# EAGLE design M2k_Breadboard_r1 (EAGLE 7.7.0)
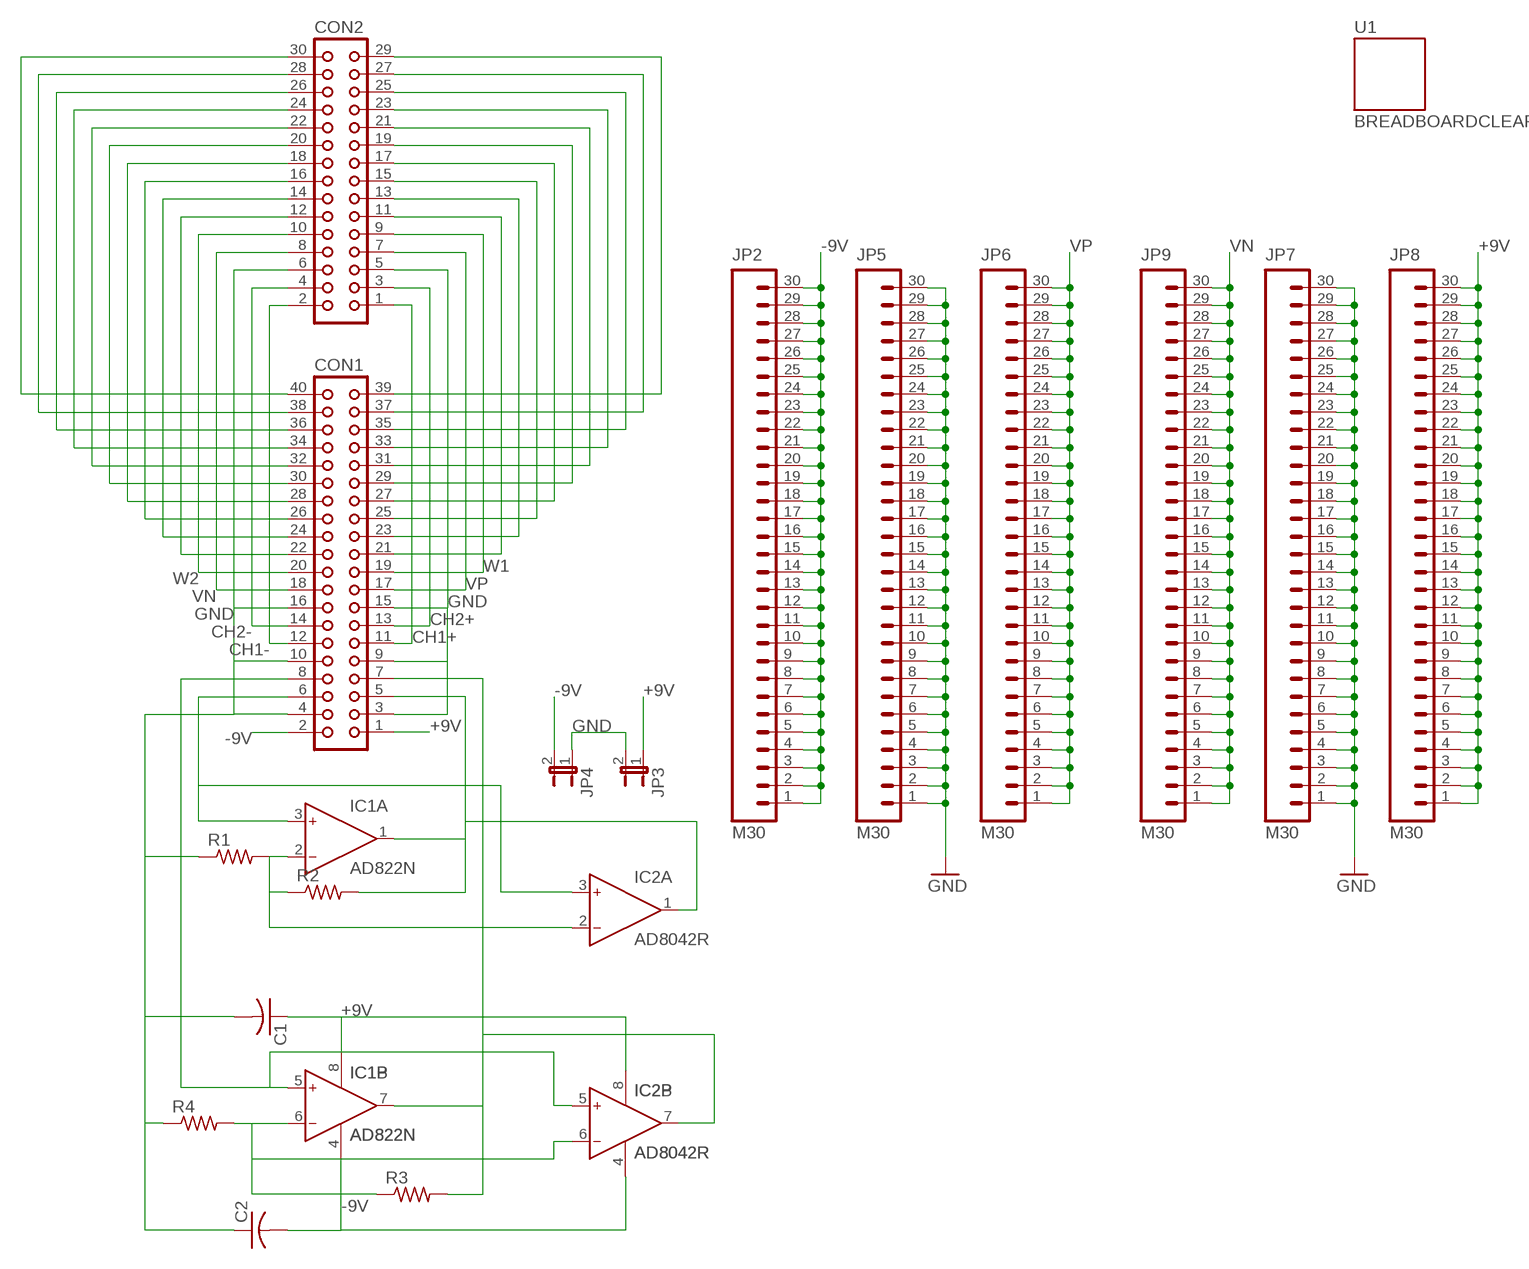
[diagram p0: schematic, sheet 1]

## Parts
C1  C-US050-024X044  [C050-024X044]
C2  C-US050-024X044  [C050-024X044]
CON1  CON40  [CON40]
CON2  CON34  [CON34]
IC1  AD822N  [DIL08]
IC2  AD8042R  [SO8]
JP2  M30  [1X30]
JP3  JP1E  [JP1]
JP4  JP1E  [JP1]
JP5  M30  [1X30]
JP6  M30  [1X30]
JP7  M30  [1X30]
JP8  M30  [1X30]
JP9  M30  [1X30]
R1  R-US_0207/7  [0207/7]
R2  R-US_0207/7  [0207/7]
R3  R-US_0207/7  [0207/7]
R4  R-US_0207/7  [0207/7]
U1  BREADBOARDCLEAR  [BREADBOARD_CLEAR]

## Nets
+9V: C1.1 CON1.1 IC1.8(P:V+) IC2.8(P:V+) JP3.1 JP8.1 JP8.2 JP8.3 JP8.4 JP8.5 JP8.6 JP8.7 JP8.8 JP8.9 JP8.10 JP8.11 JP8.12 JP8.13 JP8.14 JP8.15 JP8.16 JP8.17 JP8.18 JP8.19 JP8.20 JP8.21 JP8.22 JP8.23 JP8.24 JP8.25 JP8.26 JP8.27 JP8.28 JP8.29 JP8.30
-9V: C2.2 CON1.2 IC1.4(P:V-) IC2.4(P:V-) JP2.1 JP2.2 JP2.3 JP2.4 JP2.5 JP2.6 JP2.7 JP2.8 JP2.9 JP2.10 JP2.11 JP2.12 JP2.13 JP2.14 JP2.15 JP2.16 JP2.17 JP2.18 JP2.19 JP2.20 JP2.21 JP2.22 JP2.23 JP2.24 JP2.25 JP2.26 JP2.27 JP2.28 JP2.29 JP2.30 JP4.2
CH1+: CON1.11 CON2.1
CH1-: CON1.12 CON2.2
CH2+: CON1.13 CON2.3
CH2-: CON1.14 CON2.4
GND: C1.2 C2.1 CON1.3 CON1.4 CON1.9 CON1.10 CON1.15 CON1.16 CON2.5 CON2.6 JP3.2 JP4.1 JP5.1 JP5.2 JP5.3 JP5.4 JP5.5 JP5.6 JP5.7 JP5.8 JP5.9 JP5.10 JP5.11 JP5.12 JP5.13 JP5.14 JP5.15 JP5.16 JP5.17 JP5.18 JP5.19 JP5.20 JP5.21 JP5.22 JP5.23 JP5.24 JP5.25 JP5.26 JP5.27 JP5.28 JP5.29 JP5.30 JP7.1 JP7.2 JP7.3 JP7.4 JP7.5 JP7.6 JP7.7 JP7.8 JP7.9 JP7.10 JP7.11 JP7.12 JP7.13 JP7.14 JP7.15 JP7.16 JP7.17 JP7.18 JP7.19 JP7.20 JP7.21 JP7.22 JP7.23 JP7.24 JP7.25 JP7.26 JP7.27 JP7.28 JP7.29 JP7.30 R1.1 R4.1
N$4: CON1.5 IC1.1(A:OUT) IC2.1(A:OUT) R2.2
N$19: CON1.6 IC1.3(A:IN+) IC2.3(A:IN+)
N$32: CON1.8 IC1.5(B:IN+) IC2.5(B:IN+)
N$34: CON1.7 IC1.7(B:OUT) IC2.7(B:OUT) R3.2
N$35: IC1.6(B:IN-) IC2.6(B:IN-) R3.1 R4.2
N$50: CON1.21 CON2.11
N$65: CON1.23 CON2.13
N$81: CON1.25 CON2.15
N$83: CON1.27 CON2.17
N$85: CON1.29 CON2.19
N$86: CON1.31 CON2.21
N$101: CON1.33 CON2.23
N$116: CON1.35 CON2.25
N$132: CON1.37 CON2.27
N$134: CON1.39 CON2.29
N$153: IC1.2(A:IN-) IC2.2(A:IN-) R1.2 R2.1
N$156: CON1.22 CON2.12
N$157: CON1.24 CON2.14
N$158: CON1.26 CON2.16
N$159: CON1.28 CON2.18
N$160: CON1.30 CON2.20
N$161: CON1.32 CON2.22
N$162: CON1.34 CON2.24
N$163: CON1.36 CON2.26
N$164: CON1.38 CON2.28
N$165: CON1.40 CON2.30
VN: CON1.18 CON2.8 JP9.1 JP9.2 JP9.3 JP9.4 JP9.5 JP9.6 JP9.7 JP9.8 JP9.9 JP9.10 JP9.11 JP9.12 JP9.13 JP9.14 JP9.15 JP9.16 JP9.17 JP9.18 JP9.19 JP9.20 JP9.21 JP9.22 JP9.23 JP9.24 JP9.25 JP9.26 JP9.27 JP9.28 JP9.29 JP9.30
VP: CON1.17 CON2.7 JP6.1 JP6.2 JP6.3 JP6.4 JP6.5 JP6.6 JP6.7 JP6.8 JP6.9 JP6.10 JP6.11 JP6.12 JP6.13 JP6.14 JP6.15 JP6.16 JP6.17 JP6.18 JP6.19 JP6.20 JP6.21 JP6.22 JP6.23 JP6.24 JP6.25 JP6.26 JP6.27 JP6.28 JP6.29 JP6.30
W1: CON1.19 CON2.9
W2: CON1.20 CON2.10

## Library data of the parts
C1 C2 = rcl:C-US: CAPACITOR, American symbol
CON1 = con-harting:CON40: CONNECTOR; OC_FARNELL: unknown; OC_NEWARK: unknown
CON2 = con-harting:CON34: CONNECTOR; OC_FARNELL: unknown; OC_NEWARK: unknown
IC1 = analog-devices:AD822: Single-Supply, Rail-to-Rail Low Power FET-Input Op Amp Source: http://www.analog.com/static/imported-files/data_sheets/AD822.pdf; OC_FARNELL: 1438581; OC_NEWARK: unknown
IC2 = analog-devices:AD8042: Dual 160 MHz Rail-to-Rail Amplifier Source: http://www.analog.com/static/imported-files/data_sheets/AD8042.pdf; MF: ALTERA CORPORATION; MPN: AD8042AR; OC_FARNELL: 1424032; OC_NEWARK: 52F8034
JP2 JP5-JP9 = Local Library:M30
JP3 JP4 = jumper:JP1E: JUMPER
R1-R4 = rcl:R-US_: RESISTOR, American symbol
U1 = Local Lirary:BREADBOARD: Breadboard Mini Self Adhesive This is the mechnical outline for the very small self adhesive breadboard from SparkFun Electronics. Good for very small proto areas. SKU : PRT-07916

## Board
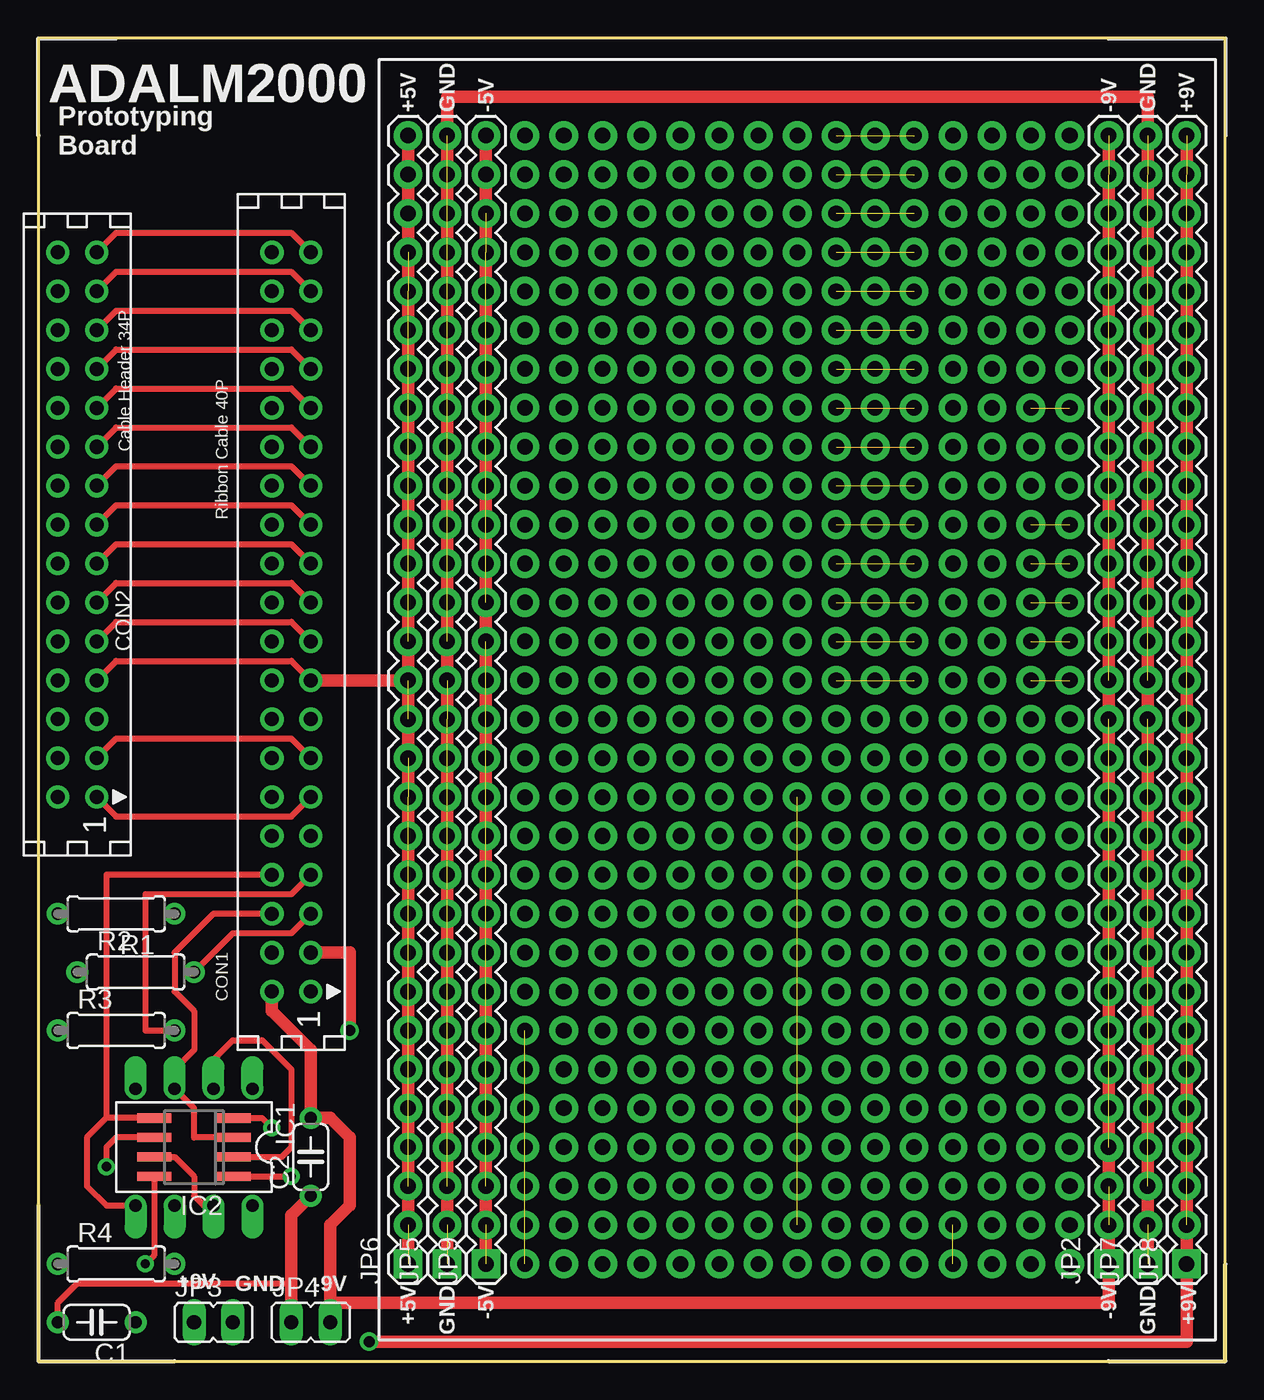
[diagram p1: board, top side]
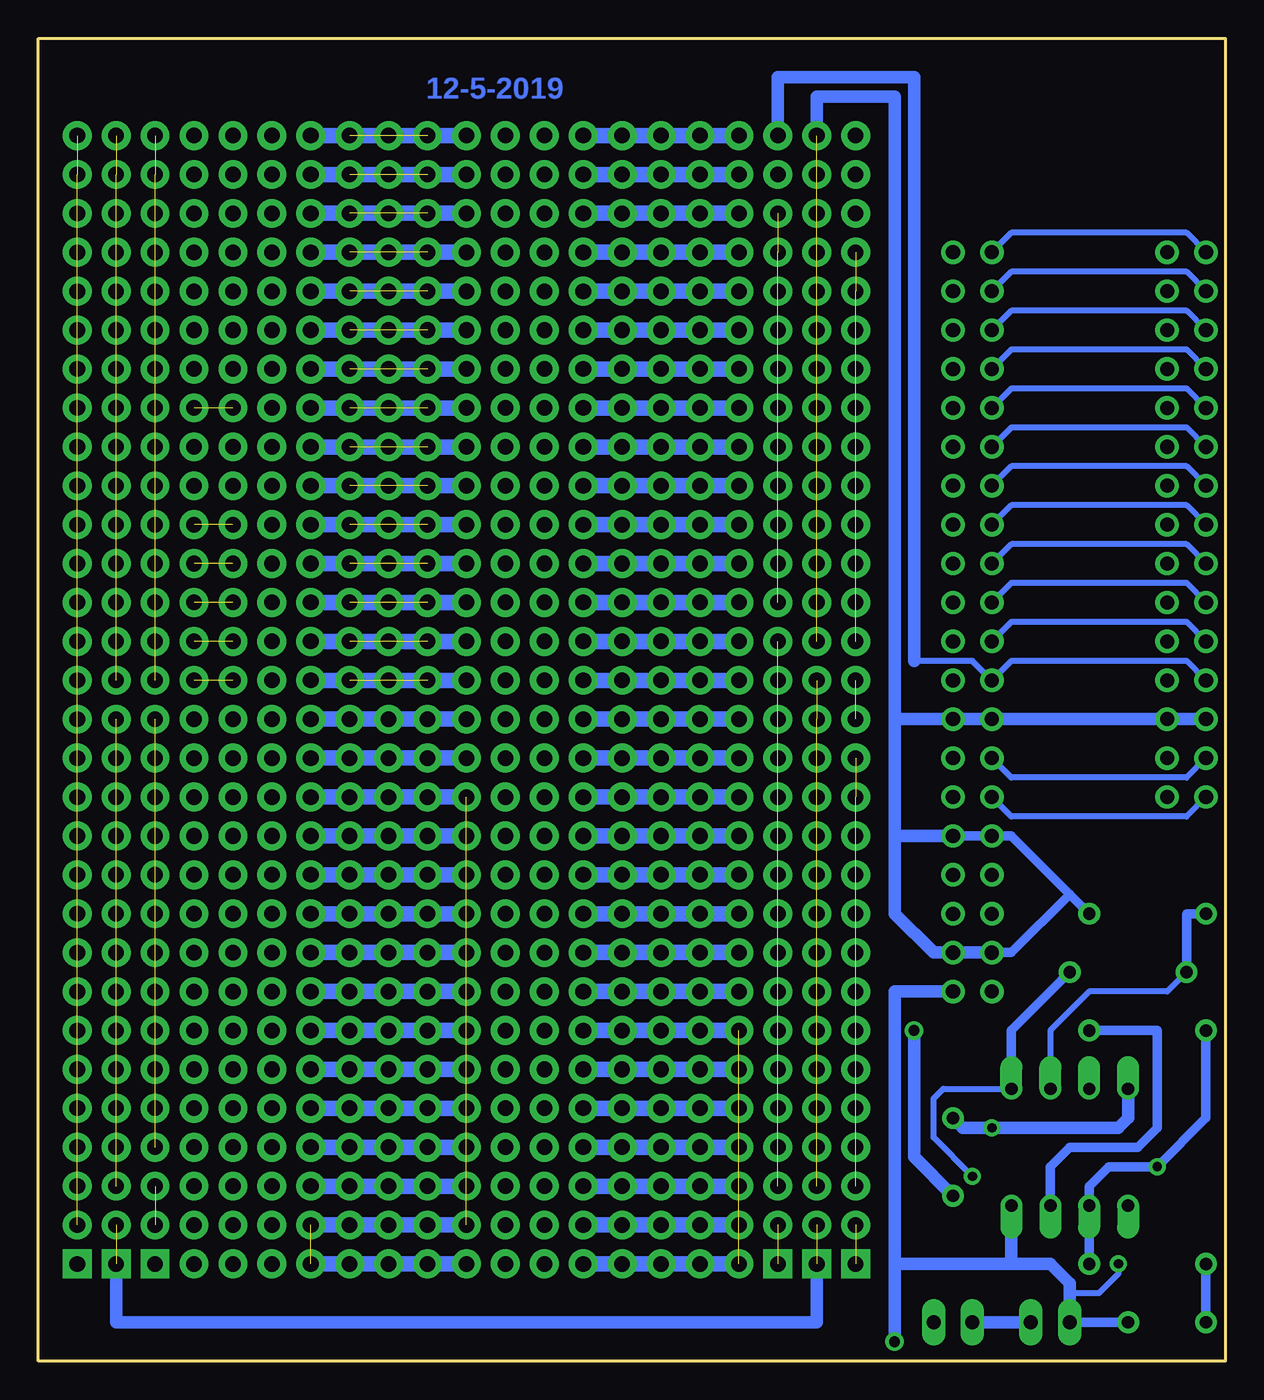
[diagram p2: board, bottom side, seen from below]

Size 77.47 x 86.36 mm. Coordinates in mm from the lower left corner, seen from the top.
Outline: 77.47,0 77.47,86.36 0,86.36 0,0 77.47,0
Copper layers (1*16): Top 0.035mm / dielectric 1.5mm / Bottom 0.035mm
Design rules "default": minimum track width 8mil, minimum drill 20mil, track to track 8mil, track to pad 8mil, pad to pad 8mil, via to via 8mil, smd to smd 8mil, copper to edge 8mil, drill to drill 8mil, minimum pad ring 12mil, minimum via ring 10mil, stop-mask expansion 4mil, vias tented up to drill 20mil, thermal gap 10mil

### Footprints (pad centres in the part's own frame; a part is rotated, then mirrored left to right if it is on the bottom)
C050-024X044 = drill 0.813: 1 -2.54,0; 2 2.54,0
CON40 = drill 0.914: 1 -24.13,-1.27; 2 -24.13,1.27; 3 -21.59,-1.27; 4 -21.59,1.27; 5 -19.05,-1.27; 6 -19.05,1.27; 7 -16.51,-1.27; 8 -16.51,1.27; 9 -13.97,-1.27; 10 -13.97,1.27; 11 -11.43,-1.27; 12 -11.43,1.27; 13 -8.89,-1.27; 14 -8.89,1.27; 15 -6.35,-1.27; 16 -6.35,1.27; 17 -3.81,-1.27; 18 -3.81,1.27; 19 -1.27,-1.27; 20 -1.27,1.27; 21 1.27,-1.27; 22 1.27,1.27; 23 3.81,-1.27; 24 3.81,1.27; 25 6.35,-1.27; 26 6.35,1.27; 27 8.89,-1.27; 28 8.89,1.27; 29 11.43,-1.27; 30 11.43,1.27; 31 13.97,-1.27; 32 13.97,1.27; 33 16.51,-1.27; 34 16.51,1.27; 35 19.05,-1.27; 36 19.05,1.27; 37 21.59,-1.27; 38 21.59,1.27; 39 24.13,-1.27; 40 24.13,1.27
CON34 = drill 0.914: 1 -20.32,-1.27; 2 -20.32,1.27; 3 -17.78,-1.27; 4 -17.78,1.27; 5 -15.24,-1.27; 6 -15.24,1.27; 7 -12.7,-1.27; 8 -12.7,1.27; 9 -10.16,-1.27; 10 -10.16,1.27; 11 -7.62,-1.27; 12 -7.62,1.27; 13 -5.08,-1.27; 14 -5.08,1.27; 15 -2.54,-1.27; 16 -2.54,1.27; 17 0,-1.27; 18 0,1.27; 19 2.54,-1.27; 20 2.54,1.27; 21 5.08,-1.27; 22 5.08,1.27; 23 7.62,-1.27; 24 7.62,1.27; 25 10.16,-1.27; 26 10.16,1.27; 27 12.7,-1.27; 28 12.7,1.27; 29 15.24,-1.27; 30 15.24,1.27
DIL08 = drill 0.813 offset: 1 -3.81,-3.81; 2 -1.27,-3.81; 3 1.27,-3.81; 4 3.81,-3.81; 5 3.81,3.81; 6 1.27,3.81; 7 -1.27,3.81; 8 -3.81,3.81
SO8 = smd 0.6 x 2.2: 1 -1.905,-2.6; 2 -0.635,-2.6; 3 0.635,-2.6; 4 1.905,-2.6; 5 1.905,2.6; 6 0.635,2.6; 7 -0.635,2.6; 8 -1.905,2.6
1X30 = drill 1.016 pad 1.88 square: 1 0,0 | drill 1.016 pad 1.88: 2 2.54,0; 3 5.08,0; 4 7.62,0; 5 10.16,0; 6 12.7,0; 7 15.24,0; 8 17.78,0; 9 20.32,0; 10 22.86,0; 11 25.4,0; 12 27.94,0; 13 30.48,0; 14 33.02,0; 15 35.56,0; 16 38.1,0; 17 40.64,0; 18 43.18,0; 19 45.72,0; 20 48.26,0; 21 50.8,0; 22 53.34,0; 23 55.88,0; 24 58.42,0; 25 60.96,0; 26 63.5,0; 27 66.04,0; 28 68.58,0; 29 71.12,0; 30 73.66,0
JP1 = drill 0.914 long: 1 0,-1.27; 2 0,1.27
0207/7 = drill 0.813: 1 -3.81,0; 2 3.81,0

### Placement (x,y rotation side)
C1  3.81,2.54 180 top
C2  17.78,13.34 90 top
CON1  16.51,48.26 90 top
CON2  2.54,57.15 90 top
IC1  10.16,13.97 180 top
IC2  10.16,13.97 90 top
JP2  69.85,6.35 90 top
JP3  11.43,2.54 270 top
JP4  17.78,2.54 270 top
JP5  26.67,6.35 90 top
JP6  24.13,6.35 90 top
JP7  72.39,6.35 90 top
JP8  74.93,6.35 90 top
JP9  29.21,6.35 90 top
R1  5.08,29.21 180 top
R2  6.35,25.4 0 top
R3  5.08,21.59 0 top
R4  5.08,6.35 0 top
U1  49.53,43.18 90 top

### Tracks (layer width: path | path; a pad name or v marks a point on that pad's centre or on a via)
+9V  (via drill 0.6, 0.7)  (28 unrouted)
  Top 0.406: IC2.8 7.56,6.92 v6.99,6.35
  Top 0.813: v21.59,1.27 74.93,1.27 JP8.1 JP8.30
  Bottom 0.406: v6.99,6.35 6.99,5.71 8.26,4.45 10.16,4.45
  Bottom 0.61: JP8.30 74.8,80.01 | C1.1 JP3.1
  Bottom 0.813: 13.97,6.35 11.43,6.35 10.16,5.08 10.16,4.45 JP3.1 | CON1.1 21.59,24.13 21.59,6.35 | 21.59,6.35 13.97,6.35 | 13.97,6.35 IC1.8 | 21.59,6.35 v21.59,1.27
-9V  (via drill 0.6)  (26 unrouted)
  Top 0.203: JP2.1 JP2.2
  Top 0.406: IC2.4 14.61,15.88 v15.24,15.24
  Top 0.813: CON1.2 15.24,22.86 17.78,20.32 C2.2 19.05,15.88 20.32,14.61 20.32,10.16 19.05,8.89 JP4.2 19.05,3.81 69.85,3.81 JP2.2 JP2.15 JP2.30
  Bottom 0.813: IC1.4 6.35,15.88 6.99,15.24 v15.24,15.24 17.14,15.24 C2.2
CH1+
  Top 0.406: CON2.1 5.08,35.56 16.51,35.56 CON1.11
CH1-
  Bottom 0.406: CON2.2 2.54,35.56 13.97,35.56 CON1.12
CH2+
  Top 0.406: CON2.3 5.08,40.64 16.51,40.64 CON1.13
CH2-
  Bottom 0.406: CON2.4 2.54,38.1 13.97,38.1 CON1.14
GND  (via drill 0.7)  (54 unrouted)
  Top 0.406: C1.2 1.27,3.81 2.54,5.08 16.51,5.08
  Top 0.813: JP4.1 16.51,5.08 16.51,9.53 C2.1 | JP5.1 JP5.15 JP5.30 26.67,82.55 72.39,82.55 JP7.30 JP7.15 JP7.1 | v20.32,21.59 20.32,26.67 CON1.3
  Bottom 0.61: C1.2 R4.1 | R1.1 10.16,30.48 | 10.16,30.48 13.97,34.29 CON1.10 CON1.9 | CON1.3 CON1.4 13.97,26.67 10.16,30.48
  Bottom 0.813: JP7.1 72.39,2.54 26.67,2.54 JP5.1 | JP3.2 JP4.1 | CON1.4 19.05,26.67 21.59,29.21 21.59,34.29 | 21.59,34.29 CON1.9 | 21.59,41.91 CON1.15 CON1.16 CON2.5 CON2.6 | 21.59,41.91 21.59,34.29 | 21.59,41.91 21.59,82.55 26.67,82.55 JP5.30 | C2.1 20.32,13.34 v20.32,21.59
N$1  (via drill 1.02 pad 1.88)
  other vias: 64.77,77.47
N$2  (via drill 1.02 pad 1.88)
  other vias: 67.31,77.47
N$3  (via drill 1.02 pad 1.88)
  other vias: 44.45,77.47
N$4  (via drill 0.6)
  Top 0.406: CON1.5 16.51,27.94 12.7,27.94 R2.2 | IC2.1 v16.51,12.06
  Bottom 0.406: v16.51,12.06 19.05,14.61 19.05,17.14 18.41,17.78 IC1.1
  Bottom 0.61: IC1.1 13.97,21.59 R2.2
N$5  (via drill 1.02 pad 1.88)
  Bottom 1.016: v31.75,80.01 v41.91,80.01
N$6  (via drill 1.02 pad 1.88)
  other vias: 34.29,80.01
N$7  (via drill 1.02 pad 1.88)
  other vias: 62.23,54.61
N$8  (via drill 1.02 pad 1.88)
  other vias: 39.37,80.01
N$9  (via drill 1.02 pad 1.88)
  other vias: 36.83,80.01
N$10  (via drill 1.02 pad 1.88)
  Bottom 1.016: v59.69,80.01 v49.53,80.01
N$11  (via drill 1.02 pad 1.88)
  other vias: 46.99,80.01
N$12  (via drill 1.02 pad 1.88)
  other vias: 62.23,57.15
N$13  (via drill 1.02 pad 1.88)  (1 unrouted)
  other vias: 52.07,80.01 57.15,80.01
N$14  (via drill 1.02 pad 1.88)
  other vias: 54.61,80.01
N$15  (via drill 1.02 pad 1.88)
  other vias: 64.77,57.15
N$17  (via drill 1.02 pad 1.88)
  other vias: 62.23,46.99
N$18  (via drill 1.02 pad 1.88)
  other vias: 44.45,80.01
N$19
  Top 0.406: CON1.6 11.43,29.21 8.89,26.67 8.89,24.13 10.16,22.86 10.16,20.32 8.89,19.05 IC1.3 10.16,16.51 10.16,14.61 IC2.3
N$20  (via drill 1.02 pad 1.88)
  Bottom 1.016: v31.75,77.47 v41.91,77.47
N$21  (via drill 1.02 pad 1.88)
  other vias: 34.29,77.47
N$22  (via drill 1.02 pad 1.88)
  other vias: 62.23,49.53
N$23  (via drill 1.02 pad 1.88)
  other vias: 39.37,77.47
N$24  (via drill 1.02 pad 1.88)
  other vias: 36.83,77.47
N$25  (via drill 1.02 pad 1.88)
  Bottom 1.016: v59.69,77.47 v49.53,77.47
N$26  (via drill 1.02 pad 1.88)
  other vias: 46.99,77.47
N$27  (via drill 1.02 pad 1.88)
  other vias: 62.23,52.07
N$28  (via drill 1.02 pad 1.88)  (1 unrouted)
  other vias: 52.07,77.47 57.15,77.47
N$29  (via drill 1.02 pad 1.88)
  other vias: 54.61,77.47
N$30  (via drill 1.02 pad 1.88)
  other vias: 64.77,59.69
N$31  (via drill 1.02 pad 1.88)
  other vias: 67.31,80.01
N$32
  Top 0.406: CON1.8 4.45,31.75 4.45,15.88 | 4.45,15.88 3.18,14.61 3.18,11.43 4.45,10.16 IC1.5 | IC2.5 4.45,15.88
N$33  (via drill 1.02 pad 1.88)
  other vias: 64.77,64.77
N$34
  Top 0.406: CON1.7 16.51,30.48 6.99,30.48 6.99,21.59 R3.2 | IC2.7 8.89,13.34 10.16,12.06 10.16,10.79 10.79,10.16 IC1.7
  Bottom 0.61: IC1.7 11.43,12.7 10.16,13.97 5.71,13.97 4.45,15.24 4.45,21.59 R3.2
N$35  (via drill 0.6)
  Top 0.406: IC2.6 5.08,14.61 4.45,13.97 v4.45,12.7
  Bottom 0.61: R4.2 IC1.6 8.89,11.43 7.62,12.7 v4.45,12.7 1.27,15.88 R3.1
N$36  (via drill 1.02 pad 1.88)
  other vias: 62.23,39.37
N$37  (via drill 1.02 pad 1.88)
  other vias: 34.29,74.93
N$38  (via drill 1.02 pad 1.88)
  Bottom 1.016: v31.75,74.93 v41.91,74.93
N$39  (via drill 1.02 pad 1.88)
  other vias: 39.37,74.93
N$40  (via drill 1.02 pad 1.88)
  other vias: 36.83,74.93
N$41  (via drill 1.02 pad 1.88)
  Bottom 1.016: v59.69,74.93 v49.53,74.93
N$42  (via drill 1.02 pad 1.88)
  other vias: 46.99,74.93
N$43  (via drill 1.02 pad 1.88)
  other vias: 64.77,67.31
N$44  (via drill 1.02 pad 1.88)  (1 unrouted)
  other vias: 52.07,74.93 57.15,74.93
N$45  (via drill 1.02 pad 1.88)
  other vias: 54.61,74.93
N$46  (via drill 1.02 pad 1.88)
  other vias: 64.77,69.85
N$47  (via drill 1.02 pad 1.88)
  other vias: 64.77,72.39
N$48  (via drill 1.02 pad 1.88)
  other vias: 67.31,69.85
N$49  (via drill 1.02 pad 1.88)
  other vias: 44.45,69.85
N$50
  Top 0.406: CON2.11 5.08,50.8 16.51,50.8 CON1.21
N$51  (via drill 1.02 pad 1.88)
  Bottom 1.016: v31.75,72.39 v41.91,72.39
N$52  (via drill 1.02 pad 1.88)
  other vias: 34.29,72.39
N$53  (via drill 1.02 pad 1.88)
  other vias: 62.23,41.91
N$54  (via drill 1.02 pad 1.88)
  other vias: 39.37,72.39
N$55  (via drill 1.02 pad 1.88)
  other vias: 36.83,72.39
N$56  (via drill 1.02 pad 1.88)
  Bottom 1.016: v59.69,72.39 v49.53,72.39
N$57  (via drill 1.02 pad 1.88)
  other vias: 46.99,72.39
N$58  (via drill 1.02 pad 1.88)
  other vias: 64.77,74.93
N$59  (via drill 1.02 pad 1.88)  (1 unrouted)
  other vias: 52.07,72.39 57.15,72.39
N$60  (via drill 1.02 pad 1.88)
  other vias: 54.61,72.39
N$61  (via drill 1.02 pad 1.88)
  other vias: 64.77,80.01
N$63  (via drill 1.02 pad 1.88)
  other vias: 67.31,72.39
N$64  (via drill 1.02 pad 1.88)
  other vias: 44.45,72.39
N$65
  Top 0.406: CON2.13 5.08,53.34 16.51,53.34 CON1.23
N$66  (via drill 1.02 pad 1.88)
  Bottom 1.016: v31.75,69.85 v41.91,69.85
N$67  (via drill 1.02 pad 1.88)
  other vias: 34.29,69.85
N$68  (via drill 1.02 pad 1.88)
  other vias: 62.23,44.45
N$69  (via drill 1.02 pad 1.88)
  other vias: 39.37,69.85
N$70  (via drill 1.02 pad 1.88)
  other vias: 36.83,69.85
N$71  (via drill 1.02 pad 1.88)
  Bottom 1.016: v59.69,69.85 v49.53,69.85
N$72  (via drill 1.02 pad 1.88)
  other vias: 46.99,69.85
N$74  (via drill 1.02 pad 1.88)  (1 unrouted)
  other vias: 52.07,69.85 57.15,69.85
N$75  (via drill 1.02 pad 1.88)
  other vias: 54.61,69.85
N$78  (via drill 1.02 pad 1.88)
  other vias: 67.31,74.93
N$79  (via drill 1.02 pad 1.88)
  other vias: 44.45,74.93
N$81
  Top 0.406: CON2.15 5.08,55.88 16.51,55.88 CON1.25
N$83
  Top 0.406: CON2.17 5.08,58.42 16.51,58.42 CON1.27
N$85
  Top 0.406: CON2.19 5.08,60.96 16.51,60.96 CON1.29
N$86
  Top 0.406: CON2.21 5.08,63.5 16.51,63.5 CON1.31
N$87  (via drill 1.02 pad 1.88)
  Bottom 1.016: v31.75,67.31 v41.91,67.31
N$88  (via drill 1.02 pad 1.88)
  other vias: 34.29,67.31
N$90  (via drill 1.02 pad 1.88)
  other vias: 39.37,67.31
N$91  (via drill 1.02 pad 1.88)
  other vias: 36.83,67.31
N$92  (via drill 1.02 pad 1.88)
  Bottom 1.016: v59.69,67.31 v49.53,67.31
N$93  (via drill 1.02 pad 1.88)
  other vias: 46.99,67.31
N$95  (via drill 1.02 pad 1.88)  (1 unrouted)
  other vias: 52.07,67.31 57.15,67.31
N$96  (via drill 1.02 pad 1.88)
  other vias: 54.61,67.31
N$99  (via drill 1.02 pad 1.88)  (1 unrouted)
  other vias: 64.77,62.23 67.31,62.23
N$100  (via drill 1.02 pad 1.88)
  other vias: 44.45,62.23
N$101
  Top 0.406: CON2.23 5.08,66.04 16.51,66.04 CON1.33
N$102  (via drill 1.02 pad 1.88)
  Bottom 1.016: v31.75,64.77 v41.91,64.77
N$103  (via drill 1.02 pad 1.88)
  other vias: 34.29,64.77
N$105  (via drill 1.02 pad 1.88)
  other vias: 39.37,64.77
N$106  (via drill 1.02 pad 1.88)
  other vias: 36.83,64.77
N$107  (via drill 1.02 pad 1.88)
  Bottom 1.016: v59.69,64.77 v49.53,64.77
N$108  (via drill 1.02 pad 1.88)
  other vias: 46.99,64.77
N$110  (via drill 1.02 pad 1.88)  (1 unrouted)
  other vias: 52.07,64.77 57.15,64.77
N$111  (via drill 1.02 pad 1.88)
  other vias: 54.61,64.77
N$114  (via drill 1.02 pad 1.88)
  other vias: 67.31,64.77
N$115  (via drill 1.02 pad 1.88)
  other vias: 44.45,64.77
N$116
  Top 0.406: CON2.25 5.08,68.58 16.51,68.58 CON1.35
N$117  (via drill 1.02 pad 1.88)
  Bottom 1.016: v31.75,62.23 v41.91,62.23
N$118  (via drill 1.02 pad 1.88)
  other vias: 34.29,62.23
N$120  (via drill 1.02 pad 1.88)
  other vias: 39.37,62.23
N$121  (via drill 1.02 pad 1.88)
  other vias: 36.83,62.23
N$122  (via drill 1.02 pad 1.88)
  Bottom 1.016: v59.69,62.23 v49.53,62.23
N$123  (via drill 1.02 pad 1.88)
  other vias: 46.99,62.23
N$125  (via drill 1.02 pad 1.88)  (1 unrouted)
  other vias: 52.07,62.23 57.15,62.23
N$126  (via drill 1.02 pad 1.88)
  other vias: 54.61,62.23
N$129  (via drill 1.02 pad 1.88)
  other vias: 67.31,67.31
N$130  (via drill 1.02 pad 1.88)
  other vias: 44.45,67.31
N$132
  Top 0.406: CON2.27 5.08,71.12 16.51,71.12 CON1.37
N$134
  Top 0.406: CON2.29 5.08,73.66 16.51,73.66 CON1.39
N$136  (via drill 1.02 pad 1.88)
  other vias: 62.23,31.75
N$137  (via drill 1.02 pad 1.88)
  other vias: 62.23,34.29
N$138  (via drill 1.02 pad 1.88)
  Bottom 1.016: v31.75,59.69 v41.91,59.69
N$139  (via drill 1.02 pad 1.88)
  other vias: 34.29,59.69
N$141  (via drill 1.02 pad 1.88)
  other vias: 39.37,59.69
N$142  (via drill 1.02 pad 1.88)
  other vias: 36.83,59.69
N$143  (via drill 1.02 pad 1.88)
  Bottom 1.016: v59.69,59.69 v49.53,59.69
N$144  (via drill 1.02 pad 1.88)
  other vias: 46.99,59.69
N$146  (via drill 1.02 pad 1.88)  (1 unrouted)
  other vias: 52.07,59.69 57.15,59.69
N$147  (via drill 1.02 pad 1.88)
  other vias: 54.61,59.69
N$150  (via drill 1.02 pad 1.88)
  other vias: 67.31,59.69
N$151  (via drill 1.02 pad 1.88)
  other vias: 44.45,59.69
N$153
  Top 0.406: IC2.2 15.88,13.34 16.51,13.97 16.51,19.05 14.61,20.95 12.7,20.95 11.43,19.68 IC1.2
  Bottom 0.406: R2.1 3.81,24.13 8.89,24.13 11.43,21.59 IC1.2
  Bottom 0.61: R1.2 2.54,29.21 R2.1
N$154  (via drill 1.02 pad 1.88)
  other vias: 62.23,36.83
N$155  (via drill 1.02 pad 1.88)
  other vias: 62.23,24.13
N$156
  Bottom 0.406: CON2.12 2.54,50.8 13.97,50.8 CON1.22
N$157
  Bottom 0.406: CON2.14 2.54,53.34 13.97,53.34 CON1.24
N$158
  Bottom 0.406: CON2.16 2.54,55.88 13.97,55.88 CON1.26
N$159
  Bottom 0.406: CON2.18 2.54,58.42 13.97,58.42 CON1.28
N$160
  Bottom 0.406: CON2.20 2.54,60.96 13.97,60.96 CON1.30
N$161
  Bottom 0.406: CON2.22 2.54,63.5 13.97,63.5 CON1.32
N$162
  Bottom 0.406: CON2.24 2.54,66.04 13.97,66.04 CON1.34
N$163
  Bottom 0.406: CON2.26 2.54,68.58 13.97,68.58 CON1.36
N$164
  Bottom 0.406: CON2.28 2.54,71.12 13.97,71.12 CON1.38
N$165
  Bottom 0.406: CON2.30 2.54,73.66 13.97,73.66 CON1.40
N$166  (via drill 1.02 pad 1.88)
  other vias: 62.23,26.67
N$167  (via drill 1.02 pad 1.88)
  other vias: 62.23,29.21
N$168  (via drill 1.02 pad 1.88)
  other vias: 62.23,16.51
N$169  (via drill 1.02 pad 1.88)
  other vias: 62.23,19.05
N$170  (via drill 1.02 pad 1.88)
  other vias: 62.23,21.59
N$171  (via drill 1.02 pad 1.88)
  other vias: 62.23,13.97
N$172  (via drill 1.02 pad 1.88)
  other vias: 62.23,6.35
N$173  (via drill 1.02 pad 1.88)
  other vias: 62.23,8.89
N$174  (via drill 1.02 pad 1.88)
  other vias: 62.23,11.43
N$175  (via drill 1.02 pad 1.88)
  other vias: 62.23,77.47
N$176  (via drill 1.02 pad 1.88)
  other vias: 62.23,80.01
N$177  (via drill 1.02 pad 1.88)
  other vias: 62.23,69.85
N$178  (via drill 1.02 pad 1.88)
  other vias: 62.23,72.39
N$179  (via drill 1.02 pad 1.88)
  other vias: 62.23,74.93
N$180  (via drill 1.02 pad 1.88)
  other vias: 62.23,62.23
N$181  (via drill 1.02 pad 1.88)
  other vias: 62.23,64.77
N$182  (via drill 1.02 pad 1.88)
  other vias: 62.23,67.31
N$183  (via drill 1.02 pad 1.88)
  other vias: 62.23,59.69
N$216  (via drill 1.02 pad 1.88)  (1 unrouted)
  other vias: 64.77,54.61 67.31,54.61
N$217  (via drill 1.02 pad 1.88)
  other vias: 44.45,54.61
N$221  (via drill 1.02 pad 1.88)
  Bottom 1.016: v31.75,57.15 v41.91,57.15
N$222  (via drill 1.02 pad 1.88)
  other vias: 34.29,57.15
N$224  (via drill 1.02 pad 1.88)
  other vias: 39.37,57.15
N$225  (via drill 1.02 pad 1.88)
  other vias: 36.83,57.15
N$226  (via drill 1.02 pad 1.88)
  Bottom 1.016: v59.69,57.15 v49.53,57.15
N$227  (via drill 1.02 pad 1.88)
  other vias: 46.99,57.15
N$229  (via drill 1.02 pad 1.88)  (1 unrouted)
  other vias: 52.07,57.15 57.15,57.15
N$230  (via drill 1.02 pad 1.88)
  other vias: 54.61,57.15
N$233  (via drill 1.02 pad 1.88)
  other vias: 67.31,57.15
N$234  (via drill 1.02 pad 1.88)
  other vias: 44.45,57.15
N$238  (via drill 1.02 pad 1.88)
  Bottom 1.016: v31.75,54.61 v41.91,54.61
N$239  (via drill 1.02 pad 1.88)
  other vias: 34.29,54.61
N$241  (via drill 1.02 pad 1.88)
  other vias: 39.37,54.61
N$242  (via drill 1.02 pad 1.88)
  other vias: 36.83,54.61
N$243  (via drill 1.02 pad 1.88)
  Bottom 1.016: v59.69,54.61 v49.53,54.61
N$244  (via drill 1.02 pad 1.88)
  other vias: 46.99,54.61
N$246  (via drill 1.02 pad 1.88)  (1 unrouted)
  other vias: 52.07,54.61 57.15,54.61
N$247  (via drill 1.02 pad 1.88)
  other vias: 54.61,54.61
N$264  (via drill 1.02 pad 1.88)
  Bottom 1.016: v31.75,52.07 v41.91,52.07
N$265  (via drill 1.02 pad 1.88)
  other vias: 34.29,52.07
N$267  (via drill 1.02 pad 1.88)
  other vias: 39.37,52.07
N$268  (via drill 1.02 pad 1.88)
  other vias: 36.83,52.07
N$269  (via drill 1.02 pad 1.88)
  Bottom 1.016: v59.69,52.07 v49.53,52.07
N$270  (via drill 1.02 pad 1.88)
  other vias: 46.99,52.07
N$272  (via drill 1.02 pad 1.88)  (1 unrouted)
  other vias: 52.07,52.07 57.15,52.07
N$273  (via drill 1.02 pad 1.88)
  other vias: 54.61,52.07
N$276  (via drill 1.02 pad 1.88)  (1 unrouted)
  other vias: 64.77,46.99 67.31,46.99
N$277  (via drill 1.02 pad 1.88)
  other vias: 44.45,46.99
N$281  (via drill 1.02 pad 1.88)
  Bottom 1.016: v31.75,49.53 v41.91,49.53
N$282  (via drill 1.02 pad 1.88)
  other vias: 34.29,49.53
N$284  (via drill 1.02 pad 1.88)
  other vias: 39.37,49.53
N$285  (via drill 1.02 pad 1.88)
  other vias: 36.83,49.53
N$286  (via drill 1.02 pad 1.88)
  Bottom 1.016: v59.69,49.53 v49.53,49.53
N$287  (via drill 1.02 pad 1.88)
  other vias: 46.99,49.53
N$289  (via drill 1.02 pad 1.88)  (1 unrouted)
  other vias: 52.07,49.53 57.15,49.53
N$290  (via drill 1.02 pad 1.88)
  other vias: 54.61,49.53
N$293  (via drill 1.02 pad 1.88)  (1 unrouted)
  other vias: 64.77,49.53 67.31,49.53
N$294  (via drill 1.02 pad 1.88)
  other vias: 44.45,49.53
N$298  (via drill 1.02 pad 1.88)
  Bottom 1.016: v31.75,46.99 v41.91,46.99
N$299  (via drill 1.02 pad 1.88)
  other vias: 34.29,46.99
N$301  (via drill 1.02 pad 1.88)
  other vias: 39.37,46.99
N$302  (via drill 1.02 pad 1.88)
  other vias: 36.83,46.99
N$303  (via drill 1.02 pad 1.88)
  Bottom 1.016: v59.69,46.99 v49.53,46.99
N$304  (via drill 1.02 pad 1.88)
  other vias: 46.99,46.99
N$306  (via drill 1.02 pad 1.88)  (1 unrouted)
  other vias: 52.07,46.99 57.15,46.99
N$307  (via drill 1.02 pad 1.88)
  other vias: 54.61,46.99
N$310  (via drill 1.02 pad 1.88)  (1 unrouted)
  other vias: 64.77,52.07 67.31,52.07
N$311  (via drill 1.02 pad 1.88)
  other vias: 44.45,52.07
N$324  (via drill 1.02 pad 1.88)
  Bottom 1.016: v31.75,44.45 v41.91,44.45
N$325  (via drill 1.02 pad 1.88)
  other vias: 34.29,44.45
N$327  (via drill 1.02 pad 1.88)
  other vias: 39.37,44.45
N$328  (via drill 1.02 pad 1.88)
  other vias: 36.83,44.45
N$329  (via drill 1.02 pad 1.88)
  Bottom 1.016: v59.69,44.45 v49.53,44.45
N$330  (via drill 1.02 pad 1.88)
  other vias: 46.99,44.45
N$332  (via drill 1.02 pad 1.88)  (1 unrouted)
  other vias: 52.07,44.45 57.15,44.45
N$333  (via drill 1.02 pad 1.88)
  other vias: 54.61,44.45
N$336  (via drill 1.02 pad 1.88)
  other vias: 64.77,39.37
N$337  (via drill 1.02 pad 1.88)
  other vias: 44.45,39.37
N$341  (via drill 1.02 pad 1.88)
  Bottom 1.016: v31.75,41.91 v41.91,41.91
N$342  (via drill 1.02 pad 1.88)
  other vias: 34.29,41.91
N$344  (via drill 1.02 pad 1.88)
  other vias: 39.37,41.91
N$345  (via drill 1.02 pad 1.88)
  other vias: 36.83,41.91
N$346  (via drill 1.02 pad 1.88)
  Bottom 1.016: v59.69,41.91 v49.53,41.91
N$347  (via drill 1.02 pad 1.88)
  other vias: 46.99,41.91
N$349  (via drill 1.02 pad 1.88)
  other vias: 52.07,41.91
N$350  (via drill 1.02 pad 1.88)
  other vias: 54.61,41.91
N$351  (via drill 1.02 pad 1.88)
  other vias: 57.15,41.91
N$353  (via drill 1.02 pad 1.88)
  other vias: 64.77,41.91
N$354  (via drill 1.02 pad 1.88)
  other vias: 44.45,41.91
N$358  (via drill 1.02 pad 1.88)
  Bottom 1.016: v31.75,39.37 v41.91,39.37
N$359  (via drill 1.02 pad 1.88)
  other vias: 34.29,39.37
N$361  (via drill 1.02 pad 1.88)
  other vias: 39.37,39.37
N$362  (via drill 1.02 pad 1.88)
  other vias: 36.83,39.37
N$363  (via drill 1.02 pad 1.88)
  Bottom 1.016: v59.69,39.37 v49.53,39.37
N$364  (via drill 1.02 pad 1.88)
  other vias: 46.99,39.37
N$366  (via drill 1.02 pad 1.88)
  other vias: 52.07,39.37
N$367  (via drill 1.02 pad 1.88)
  other vias: 54.61,39.37
N$368  (via drill 1.02 pad 1.88)
  other vias: 57.15,39.37
N$370  (via drill 1.02 pad 1.88)  (1 unrouted)
  other vias: 64.77,44.45 67.31,44.45
N$371  (via drill 1.02 pad 1.88)
  other vias: 44.45,44.45
N$375  (via drill 1.02 pad 1.88)
  other vias: 67.31,41.91
N$378  (via drill 1.02 pad 1.88)
  other vias: 67.31,39.37
N$384  (via drill 1.02 pad 1.88)
  Bottom 1.016: v31.75,36.83 v41.91,36.83
N$385  (via drill 1.02 pad 1.88)
  other vias: 34.29,36.83
N$387  (via drill 1.02 pad 1.88)
  other vias: 39.37,36.83
N$388  (via drill 1.02 pad 1.88)
  other vias: 36.83,36.83
N$389  (via drill 1.02 pad 1.88)  (12 unrouted)
  Bottom 1.016: v49.53,36.83 59.69,36.83 | 49.53,34.29 59.69,34.29 | 49.53,31.75 59.69,31.75 | 49.53,29.21 59.69,29.21 | 49.53,26.67 59.69,26.67 | 49.53,24.13 59.69,24.13 | 49.53,21.59 59.69,21.59 | 49.53,19.05 59.69,19.05 | 49.53,16.51 59.69,16.51 | 49.53,13.97 59.69,13.97 | 49.53,11.43 59.69,11.43 | 49.53,8.89 59.69,8.89 | 59.69,6.35 49.53,6.35
N$390  (via drill 1.02 pad 1.88)
  other vias: 46.99,36.83
N$391  (via drill 1.02 pad 1.88)
  other vias: 44.45,36.83
N$392  (via drill 1.02 pad 1.88)
  other vias: 52.07,36.83
N$393  (via drill 1.02 pad 1.88)
  other vias: 54.61,36.83
N$394  (via drill 1.02 pad 1.88)
  other vias: 57.15,36.83
N$396  (via drill 1.02 pad 1.88)
  other vias: 64.77,31.75
N$397  (via drill 1.02 pad 1.88)
  other vias: 59.69,31.75
N$401  (via drill 1.02 pad 1.88)
  Bottom 1.016: v31.75,34.29 v41.91,34.29
N$402  (via drill 1.02 pad 1.88)
  other vias: 34.29,34.29
N$404  (via drill 1.02 pad 1.88)
  other vias: 39.37,34.29
N$405  (via drill 1.02 pad 1.88)
  other vias: 36.83,34.29
N$406  (via drill 1.02 pad 1.88)
  other vias: 44.45,34.29
N$407  (via drill 1.02 pad 1.88)
  other vias: 46.99,34.29
N$408  (via drill 1.02 pad 1.88)
  other vias: 49.53,34.29
N$409  (via drill 1.02 pad 1.88)
  other vias: 52.07,34.29
N$410  (via drill 1.02 pad 1.88)
  other vias: 54.61,34.29
N$411  (via drill 1.02 pad 1.88)
  other vias: 57.15,34.29
N$413  (via drill 1.02 pad 1.88)
  other vias: 64.77,34.29
N$414  (via drill 1.02 pad 1.88)
  other vias: 59.69,34.29
N$418  (via drill 1.02 pad 1.88)
  Bottom 1.016: v31.75,31.75 v41.91,31.75
N$419  (via drill 1.02 pad 1.88)
  other vias: 34.29,31.75
N$421  (via drill 1.02 pad 1.88)
  other vias: 39.37,31.75
N$422  (via drill 1.02 pad 1.88)
  other vias: 36.83,31.75
N$423  (via drill 1.02 pad 1.88)
  other vias: 44.45,31.75
N$424  (via drill 1.02 pad 1.88)
  other vias: 46.99,31.75
N$425  (via drill 1.02 pad 1.88)
  other vias: 49.53,31.75
N$426  (via drill 1.02 pad 1.88)
  other vias: 52.07,31.75
N$427  (via drill 1.02 pad 1.88)
  other vias: 54.61,31.75
N$428  (via drill 1.02 pad 1.88)
  other vias: 57.15,31.75
N$430  (via drill 1.02 pad 1.88)
  other vias: 64.77,36.83
N$431  (via drill 1.02 pad 1.88)
  other vias: 59.69,36.83
N$432  (via drill 1.02 pad 1.88)
  other vias: 67.31,36.83
N$435  (via drill 1.02 pad 1.88)
  other vias: 67.31,34.29
N$438  (via drill 1.02 pad 1.88)
  other vias: 67.31,31.75
N$444  (via drill 1.02 pad 1.88)
  Bottom 1.016: v31.75,29.21 v41.91,29.21
N$445  (via drill 1.02 pad 1.88)
  other vias: 34.29,29.21
N$447  (via drill 1.02 pad 1.88)
  other vias: 39.37,29.21
N$448  (via drill 1.02 pad 1.88)
  other vias: 36.83,29.21
N$449  (via drill 1.02 pad 1.88)
  other vias: 44.45,29.21
N$450  (via drill 1.02 pad 1.88)
  other vias: 46.99,29.21
N$451  (via drill 1.02 pad 1.88)
  other vias: 49.53,29.21
N$452  (via drill 1.02 pad 1.88)
  other vias: 52.07,29.21
N$453  (via drill 1.02 pad 1.88)
  other vias: 54.61,29.21
N$454  (via drill 1.02 pad 1.88)
  other vias: 57.15,29.21
N$456  (via drill 1.02 pad 1.88)
  other vias: 64.77,24.13
N$457  (via drill 1.02 pad 1.88)
  other vias: 59.69,24.13
N$461  (via drill 1.02 pad 1.88)
  Bottom 1.016: v31.75,26.67 v41.91,26.67
N$462  (via drill 1.02 pad 1.88)
  other vias: 34.29,26.67
N$464  (via drill 1.02 pad 1.88)
  other vias: 39.37,26.67
N$465  (via drill 1.02 pad 1.88)
  other vias: 36.83,26.67
N$466  (via drill 1.02 pad 1.88)
  other vias: 44.45,26.67
N$467  (via drill 1.02 pad 1.88)
  other vias: 46.99,26.67
N$468  (via drill 1.02 pad 1.88)
  other vias: 49.53,26.67
N$469  (via drill 1.02 pad 1.88)
  other vias: 52.07,26.67
N$470  (via drill 1.02 pad 1.88)
  other vias: 54.61,26.67
N$471  (via drill 1.02 pad 1.88)
  other vias: 57.15,26.67
N$473  (via drill 1.02 pad 1.88)
  other vias: 64.77,26.67
N$474  (via drill 1.02 pad 1.88)
  other vias: 59.69,26.67
N$478  (via drill 1.02 pad 1.88)
  Bottom 1.016: v31.75,24.13 v41.91,24.13
N$479  (via drill 1.02 pad 1.88)
  other vias: 34.29,24.13
N$481  (via drill 1.02 pad 1.88)
  other vias: 39.37,24.13
N$482  (via drill 1.02 pad 1.88)
  other vias: 36.83,24.13
N$483  (via drill 1.02 pad 1.88)
  other vias: 44.45,24.13
N$484  (via drill 1.02 pad 1.88)
  other vias: 46.99,24.13
N$485  (via drill 1.02 pad 1.88)
  other vias: 49.53,24.13
N$486  (via drill 1.02 pad 1.88)
  other vias: 52.07,24.13
N$487  (via drill 1.02 pad 1.88)
  other vias: 54.61,24.13
N$488  (via drill 1.02 pad 1.88)
  other vias: 57.15,24.13
N$490  (via drill 1.02 pad 1.88)
  other vias: 64.77,29.21
N$491  (via drill 1.02 pad 1.88)
  other vias: 59.69,29.21
N$492  (via drill 1.02 pad 1.88)
  other vias: 67.31,29.21
N$495  (via drill 1.02 pad 1.88)
  other vias: 67.31,26.67
N$498  (via drill 1.02 pad 1.88)
  other vias: 67.31,24.13
N$504  (via drill 1.02 pad 1.88)  (6 unrouted)
  Bottom 1.016: v31.75,21.59 v41.91,21.59 | 31.75,19.05 41.91,19.05 | 31.75,16.51 41.91,16.51 | 31.75,13.97 41.91,13.97 | 31.75,11.43 41.91,11.43 | 31.75,8.89 41.91,8.89 | 31.75,6.35 41.91,6.35
N$505  (via drill 1.02 pad 1.88)
  other vias: 34.29,21.59
N$507  (via drill 1.02 pad 1.88)
  other vias: 39.37,21.59
N$508  (via drill 1.02 pad 1.88)
  other vias: 36.83,21.59
N$509  (via drill 1.02 pad 1.88)
  other vias: 44.45,21.59
N$510  (via drill 1.02 pad 1.88)
  other vias: 46.99,21.59
N$511  (via drill 1.02 pad 1.88)
  other vias: 49.53,21.59
N$512  (via drill 1.02 pad 1.88)
  other vias: 52.07,21.59
N$513  (via drill 1.02 pad 1.88)
  other vias: 54.61,21.59
N$514  (via drill 1.02 pad 1.88)
  other vias: 57.15,21.59
N$516  (via drill 1.02 pad 1.88)
  other vias: 64.77,16.51
N$517  (via drill 1.02 pad 1.88)
  other vias: 59.69,16.51
N$521  (via drill 1.02 pad 1.88)
  other vias: 31.75,19.05
N$522  (via drill 1.02 pad 1.88)
  other vias: 34.29,19.05
N$523  (via drill 1.02 pad 1.88)
  other vias: 36.83,19.05
N$524  (via drill 1.02 pad 1.88)
  other vias: 39.37,19.05
N$525  (via drill 1.02 pad 1.88)
  other vias: 41.91,19.05
N$526  (via drill 1.02 pad 1.88)
  other vias: 44.45,19.05
N$527  (via drill 1.02 pad 1.88)
  other vias: 46.99,19.05
N$528  (via drill 1.02 pad 1.88)
  other vias: 49.53,19.05
N$529  (via drill 1.02 pad 1.88)
  other vias: 52.07,19.05
N$530  (via drill 1.02 pad 1.88)
  other vias: 54.61,19.05
N$531  (via drill 1.02 pad 1.88)
  other vias: 57.15,19.05
N$533  (via drill 1.02 pad 1.88)
  other vias: 64.77,19.05
N$534  (via drill 1.02 pad 1.88)
  other vias: 59.69,19.05
N$538  (via drill 1.02 pad 1.88)
  other vias: 31.75,16.51
N$539  (via drill 1.02 pad 1.88)
  other vias: 34.29,16.51
N$540  (via drill 1.02 pad 1.88)
  other vias: 36.83,16.51
N$541  (via drill 1.02 pad 1.88)
  other vias: 39.37,16.51
N$542  (via drill 1.02 pad 1.88)
  other vias: 41.91,16.51
N$543  (via drill 1.02 pad 1.88)
  other vias: 44.45,16.51
N$544  (via drill 1.02 pad 1.88)
  other vias: 46.99,16.51
N$545  (via drill 1.02 pad 1.88)
  other vias: 49.53,16.51
N$546  (via drill 1.02 pad 1.88)
  other vias: 52.07,16.51
N$547  (via drill 1.02 pad 1.88)
  other vias: 54.61,16.51
N$548  (via drill 1.02 pad 1.88)
  other vias: 57.15,16.51
N$550  (via drill 1.02 pad 1.88)
  other vias: 64.77,21.59
N$551  (via drill 1.02 pad 1.88)
  other vias: 59.69,21.59
N$552  (via drill 1.02 pad 1.88)
  other vias: 67.31,21.59
N$555  (via drill 1.02 pad 1.88)
  other vias: 67.31,19.05
N$558  (via drill 1.02 pad 1.88)
  other vias: 67.31,16.51
N$778  (via drill 1.02 pad 1.88)
  other vias: 64.77,13.97
N$779  (via drill 1.02 pad 1.88)
  other vias: 59.69,13.97
N$783  (via drill 1.02 pad 1.88)
  other vias: 31.75,13.97
N$784  (via drill 1.02 pad 1.88)
  other vias: 34.29,13.97
N$785  (via drill 1.02 pad 1.88)
  other vias: 36.83,13.97
N$786  (via drill 1.02 pad 1.88)
  other vias: 39.37,13.97
N$787  (via drill 1.02 pad 1.88)
  other vias: 41.91,13.97
N$788  (via drill 1.02 pad 1.88)
  other vias: 44.45,13.97
N$789  (via drill 1.02 pad 1.88)
  other vias: 46.99,13.97
N$790  (via drill 1.02 pad 1.88)
  other vias: 49.53,13.97
N$791  (via drill 1.02 pad 1.88)
  other vias: 52.07,13.97
N$792  (via drill 1.02 pad 1.88)
  other vias: 54.61,13.97
N$793  (via drill 1.02 pad 1.88)
  other vias: 57.15,13.97
N$794  (via drill 1.02 pad 1.88)
  other vias: 67.31,13.97
N$800  (via drill 1.02 pad 1.88)
  other vias: 31.75,11.43
N$801  (via drill 1.02 pad 1.88)
  other vias: 34.29,11.43
N$802  (via drill 1.02 pad 1.88)
  other vias: 36.83,11.43
N$803  (via drill 1.02 pad 1.88)
  other vias: 39.37,11.43
N$804  (via drill 1.02 pad 1.88)
  other vias: 41.91,11.43
N$805  (via drill 1.02 pad 1.88)
  other vias: 44.45,11.43
N$806  (via drill 1.02 pad 1.88)
  other vias: 46.99,11.43
N$807  (via drill 1.02 pad 1.88)
  other vias: 49.53,11.43
N$808  (via drill 1.02 pad 1.88)
  other vias: 52.07,11.43
N$809  (via drill 1.02 pad 1.88)
  other vias: 54.61,11.43
N$810  (via drill 1.02 pad 1.88)
  other vias: 57.15,11.43
N$812  (via drill 1.02 pad 1.88)
  other vias: 64.77,6.35
N$813  (via drill 1.02 pad 1.88)
  other vias: 59.69,6.35
N$817  (via drill 1.02 pad 1.88)
  other vias: 31.75,8.89
N$818  (via drill 1.02 pad 1.88)
  other vias: 34.29,8.89
N$819  (via drill 1.02 pad 1.88)
  other vias: 36.83,8.89
N$820  (via drill 1.02 pad 1.88)
  other vias: 39.37,8.89
N$821  (via drill 1.02 pad 1.88)
  other vias: 41.91,8.89
N$822  (via drill 1.02 pad 1.88)
  other vias: 44.45,8.89
N$823  (via drill 1.02 pad 1.88)
  other vias: 46.99,8.89
N$824  (via drill 1.02 pad 1.88)
  other vias: 49.53,8.89
N$825  (via drill 1.02 pad 1.88)
  other vias: 52.07,8.89
N$826  (via drill 1.02 pad 1.88)
  other vias: 54.61,8.89
N$827  (via drill 1.02 pad 1.88)
  other vias: 57.15,8.89
N$829  (via drill 1.02 pad 1.88)
  other vias: 64.77,8.89
N$830  (via drill 1.02 pad 1.88)
  other vias: 59.69,8.89
N$834  (via drill 1.02 pad 1.88)
  other vias: 31.75,6.35
N$835  (via drill 1.02 pad 1.88)
  other vias: 34.29,6.35
N$836  (via drill 1.02 pad 1.88)
  other vias: 36.83,6.35
N$837  (via drill 1.02 pad 1.88)
  other vias: 39.37,6.35
N$838  (via drill 1.02 pad 1.88)
  other vias: 41.91,6.35
N$839  (via drill 1.02 pad 1.88)
  other vias: 44.45,6.35
N$840  (via drill 1.02 pad 1.88)
  other vias: 46.99,6.35
N$841  (via drill 1.02 pad 1.88)
  other vias: 49.53,6.35
N$842  (via drill 1.02 pad 1.88)
  other vias: 52.07,6.35
N$843  (via drill 1.02 pad 1.88)
  other vias: 54.61,6.35
N$844  (via drill 1.02 pad 1.88)
  other vias: 57.15,6.35
N$846  (via drill 1.02 pad 1.88)
  other vias: 64.77,11.43
N$847  (via drill 1.02 pad 1.88)
  other vias: 59.69,11.43
N$848  (via drill 1.02 pad 1.88)
  other vias: 67.31,11.43
N$851  (via drill 1.02 pad 1.88)
  other vias: 67.31,8.89
N$854  (via drill 1.02 pad 1.88)
  other vias: 67.31,6.35
VN  (25 unrouted)
  Top 0.813: JP9.30 JP9.29 JP9.28 JP9.17 JP9.1
  Bottom 0.406: CON2.8 2.54,45.72 13.97,45.72 CON1.18 16.51,45.72 20.32,45.72
  Bottom 0.813: JP9.30 29.21,83.82 20.32,83.82 20.32,45.72
VP  (23 unrouted)
  Top 0.406: CON2.7 5.08,45.72 16.51,45.72 CON1.17
  Top 0.813: JP6.30 JP6.29 JP6.28 JP6.27 JP6.16 | JP6.16 JP6.13 JP6.1 | CON1.17 JP6.16
W1
  Top 0.406: CON2.9 5.08,48.26 16.51,48.26 CON1.19
W2
  Bottom 0.406: CON2.10 2.54,48.26 13.97,48.26 CON1.20

### Text on the board
Bottom: 12-5-2019
tPlace: ADALM2000 | +5V | GND | -5V | -9V | GND | +9V | Prototyping | Board | +9V | GND | -9V | +5V | GND | -5V | -9V | GND | +9V